# Altium schematic sheet Sensor.SchDoc
size A4; SheetNumber: 3; SheetTotal: 4
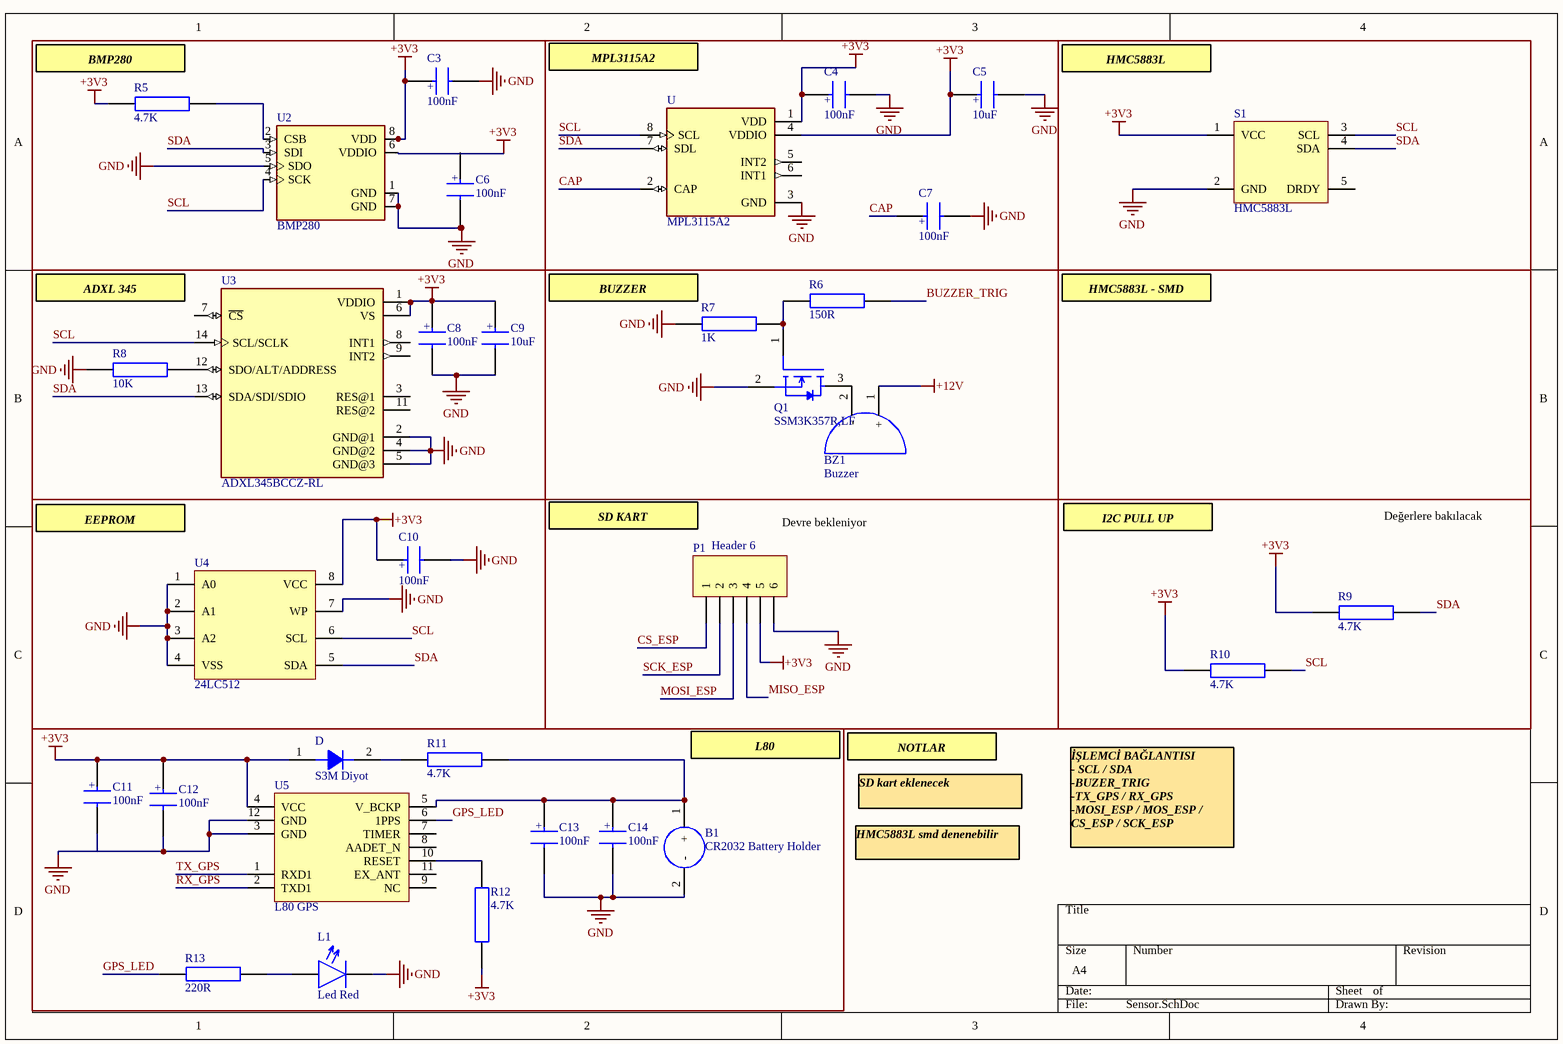
[diagram p0: Sensor.SchDoc]

## Parts
B1  CR2032 Battery Holder  [CR2032]
BZ1  Buzzer  [CMI-9605IC]
C3  100nF  [CAP_805]
C4  100nF  [CAP_805]
C5  10uF  [CAP_805]
C6  100nF  [CAP_805]
C7  100nF  [CAP_805]
C8  100nF  [CAP_805]
C9  10uF  [CAP_805]
C10  100nF  [CAP_805]
C11  100nF  [CAP_805]
C12  100nF  [CAP_805]
C13  100nF  [CAP_805]
C14  100nF  [CAP_805]
D  S3M Diyot  [DO214AA]
L1  Led Red  [Led 1206]
P1  Header 6  [HDR1X6]
Q1  SSM3K357R,LF  [SOT-23F]
R5  4.7K  [RES_1206]
R6  150R  [RES_1206]
R7  1K  [RES_1206]
R8  10K  [RES_1206]
R9  4.7K  [RES_1206]
R10  4.7K  [RES_1206]
R11  4.7K  [RES_1206]
R12  4.7K  [RES_1206]
R13  220R  [RES_1206]
S1  HMC5883L  [HMC5883L]
U  MPL3115A2  [PSON125P300X500X120-8N]
U2  BMP280  [XDCR_BMP280]
U3  ADXL345BCCZ-RL  [PQFN80P300X500X79-14N]
U4  24LC512  [soic-8]
U5  L80 GPS  [L-80]

## Nets
+3V3: C3.1 C4.1 C5.1 C8.1 C9.1 C10.1 C11.1 C12.1 D.1 P1.5 R5.1 R9.1 R10.1 R12.2 S1.1(VCC) U.1(VDD) U.4(VDDIO) U2.6(VDDIO) U2.8(VDD) U3.1(VDDIO) U3.6(VS) U4.8(VCC) U5.4(VCC)
+12V: BZ1.1(+)
GND: B1.2(-) C3.2 C4.2 C5.2 C6.2 C7.2 C8.2 C9.2 C10.2 C12.2 C13.2 C14.2 L1.2 P1.6 Q1.2(S) R7.1 R8.1 S1.2(GND) U.3(GND) U2.1(GND) U2.5(SDO) U2.7(GND) U3.2(GND@1) U3.4(GND@2) U3.5(GND@3) U4.1(A0) U4.2(A1) U4.3(A2) U4.4(VSS) U4.7(WP) U5.3(GND) U5.12(GND)
BUZZER_TRIG: R6.2
CAP: C7.1 U.2(CAP)
CS_ESP: P1.1
GPS_LED: R13.1 U5.6(1PPS)
MISO_ESP: P1.4
MOSI_ESP: P1.3
RX_GPS: U5.2(TXD1)
SCK_ESP: P1.2
SCL: R10.2 S1.3(SCL) U.8(SCL) U2.4(SCK) U3.14(SCL/SCLK) U4.6(SCL)
SDA: R9.2 S1.4(SDA) U.7(SDL) U2.3(SDI) U3.13(SDA/SDI/SDIO) U4.5(SDA)
TX_GPS: U5.1(RXD1)
NetB1_1: B1.1(+) C13.1 C14.1 R11.2 U5.5(V_BCKP)
NetBZ1_2: BZ1.2(-) Q1.3(D)
NetD_2: D.2 R11.1
NetL1_1: L1.1 R13.2
NetQ1_1: Q1.1(G) R6.1 R7.2
NetR5_2: R5.2 U2.2(CSB)
NetR8_2: R8.2 U3.12(SDO/ALT/ADDRESS)
NetR12_1: R12.1 U5.10(RESET)

Not connected (* = marked no-connect by the designer): C6 1; C11 2; S1 5(DRDY); U 5(INT2) 6(INT1); U3 3(RES@1) 7(~{CS}) 8(INT1) 9(INT2) 11(RES@2); U5 7(TIMER) 8(AADET_N) 9(NC) 11(EX_ANT)

## Notes on the sheet
- (near R5) BMP280
- (near U) MPL3115A2
- HMC5883L
- (near U3) ADXL 345
- (near R7) BUZZER
- HMC5883L - SMD
- EEPROM
- SD KART
- I2C PULL UP
- Değerlere bakılacak
- Devre bekleniyor
- L80
- NOTLAR
- HMC5883L smd denenebilir
- SD kart eklenecek
- İŞLEMCİ BAĞLANTISI
  - SCL / SDA
  -BUZER_TRIG
  -TX_GPS / RX_GPS
  -MOSI_ESP / MOS_ESP / CS_ESP / SCK_ESP
- (in symbol CAP 1uF) +

## Library data of the parts
B1 = CR2032 Battery Holder: Battery Holder
BZ1 = BUZZER: Designed by: Ahmet Azboy
C3-C14 = CAP 1uF: 0805 smd
D = S3M Diyot: Current: 3A; Voltage: 1000V; Case/Package: DO214AA
P1 = Header 6: Header, 6-Pin; LatestRevisionDate: 17-Jul-2002; LatestRevisionNote: Re-released for DXP Platform.; Publisher: Altium Limited
Q1 = SSM3K357R,LF: Trans MOSFET N-CH Si 60V 0.65A Automotive 3-Pin SOT-23F T/R; Manufacturer: Toshiba; Designed by: Ahmet Azboy; Supplier 1: Mouser; Manufacturer Part Number: SSM3K357R,LF; RoHS: No; Pricing 1: 1=0,41000, 10=0,33600, 50=0,33600, 100=0,22900, 1000=0,12900, 10000=0,10300 (USD); ComponentLink1URL: https://toshiba.semicon-storage.com/info/docget.jsp?did=59207&prodName=SSM3K357R&src-supplier=Digi-Key; ComponentLink1Description: https://toshiba.semicon-storage.com/info/docget.jsp?did=59207&prodName=SSM3K357R&src-supplier=Digi-Key; Supplier Part Number 1: 757-SSM3K357RLF; Case/Package: SOT23F
R5-R13 = RES 1K 1206
S1 = HMC5883L: Üç Eksenli Manyometre sensörü
U = MPL3115A2: Pressure Sensor 7.25PSI ~ 15.95PSI _50kPa ~ 110kPa_ Absolute 24 b 8-TLGA; MF: NXP USA; SnapEDA_Link: https://www.snapeda.com/parts/MPL3115A2/NXP%20USA%20Inc./view-part/472433/?ref=snap; Availability: Unavailable; MP: MPL3115A2; Price: None; Package: LGA-8 NXP USA; Value: *
U2 = BMP280: BMP280 Absolute Barometric Pressure Sensor for Battery Powered Devices 2 x 2.5mm; Package: None; Availability: Unavailable; MP: BMP280; Value: *; Price: None
U3 = ADXL345BCCZ-RL: Accelerometer X, Y, Z Axis Â±2g, 4g, 8g, 16g 0.05Hz ~ 1.6kHz 14-LGA (3x5); MF: Analog Devices; Check_prices: https://www.snapeda.com/parts/ADXL345BCCZ-RL/Analog%20Devices%20Inc./view-part/52306/?ref=eda; Value: *; Package: LGA -14 Analog Devices; Price: None; MP: ADXL345BCCZ-RL; Purchase-URL: https://pricing.snapeda.com/search/part/ADXL345BCCZ-RL/?ref=eda; SnapEDA_Link: https://www.snapeda.com/parts/ADXL345BCCZ-RL/Analog%20Devices%20Inc./view-part/52306/?ref=snap; Availability: Warning
U4 = 24LC512: EEPROM Serial-2Wire 512K-bit 64K x 8 3.3V/5V 8-Pin SOIJ Tube / IC EEPROM 512KBIT 400KHZ 8SOIJ; Manufacturer: Microchip; Manufacturer Part Number: 24LC512-I/SM; Access Time: 900ns; Memory Size: 512Kb; Nominal Supply Current: 5mA; Interface: I2C,Serial,2-Wire; Max Supply Voltage: 5.5V; Min Supply Voltage: 2.5V; Organization: 64KX8; Write Protection: YES; Write Cycle Time-Max (tWC): 5ms; Designed by: Ahmet Azboy; Supplier 1: RSComponents; RoHS: Yes; Category: EEPROM; Stock 1: 53; Pricing 1: 90=1,48900 (GBP); Mount: Surface Mount; Case/Package: SOIC; Number of Pins: 8; Min Operating Temperature: -40°C; Max Operating Temperature: 85°C; Packaging: Rail/Tube; Frequency: 400kHz; Density: 512Kb; Package Quantity: 90; Memory Type: EEPROM; Max Frequency: 400kHz; Access Time-Max: 900ns; Supply Current: 5mA; Programming Voltage: 5.5V; Supply Voltage-Nom: 5.5V; Length: 5.21mm; Width: 5.28mm; Height: 1.88mm; Radiation Hardening: No; Lead Free: Lead Free; RoHS Compliant: Yes; REACH SVHC: No SVHC; ComponentLink1URL: https://datasheet.ciiva.com/26870/24lc512-i-sm-26870738.pdf?src-supplier=IIIC; ComponentLink1Description: https://datasheet.ciiva.com/26870/24lc512-i-sm-26870738.pdf?src-supplier=IIIC; ComponentLink2URL: https://datasheet.ciiva.com/29294/160414-da-01-en-eeprom-24lc512-i-sm-microchip-29294348.pdf?src-supplier=Conrad; ComponentLink2Description: https://datasheet.ciiva.com/29294/160414-da-01-en-eeprom-24lc512-i-sm-microchip-29294348.pdf?src-supplier=Conrad; ComponentLink3URL: https://datasheet.ciiva.com/17651/21754m-17651369.pdf?src-supplier=Avnet+Europe; ComponentLink3Description: https://datasheet.ciiva.com/17651/21754m-17651369.pdf?src-supplier=Avnet+Europe; ComponentLink4URL: https://datasheet.ciiva.com/1155/1688094-1155274.pdf?src-supplier=Element14; ComponentLink4Description: https://datasheet.ciiva.com/1155/1688094-1155274.pdf?src-supplier=Element14; ComponentLink5URL: https://datasheet.ciiva.com/1155/1688094-1155275.pdf?src-supplier=Element14; ComponentLink5Description: https://datasheet.ciiva.com/1155/1688094-1155275.pdf?src-supplier=Element14; ComponentLink6URL: https://datasheet.ciiva.com/3184/21754m-3184956.pdf?src-supplier=Avnet; ComponentLink6Description: https://datasheet.ciiva.com/3184/21754m-3184956.pdf?src-supplier=Avnet; ComponentLink7URL: https://datasheet.ciiva.com/16921/70045251-16921949.pdf?src-supplier=Allied+Electronics; ComponentLink7Description: https://datasheet.ciiva.com/16921/70045251-16921949.pdf?src-supplier=Allied+Electronics; ComponentLink8URL: https://datasheet.ciiva.com/16304/filehandler-aspxddocname-en546203-16304574.pdf?src-supplier=Future+Electronics; ComponentLink8Description: https://datasheet.ciiva.com/16304/filehandler-aspxddocname-en546203-16304574.pdf?src-supplier=Future+Electronics; Supplier Part Number 1: 8895724
U5 = L80 GPS: Name: Quetcel L80; Designed By: Ahmet Azboy